# Altium schematic sheet MCP73831_BMS.SchDoc: MCP73831 Battery Management Unit
size A3; SheetNumber: 1; SheetTotal: 1
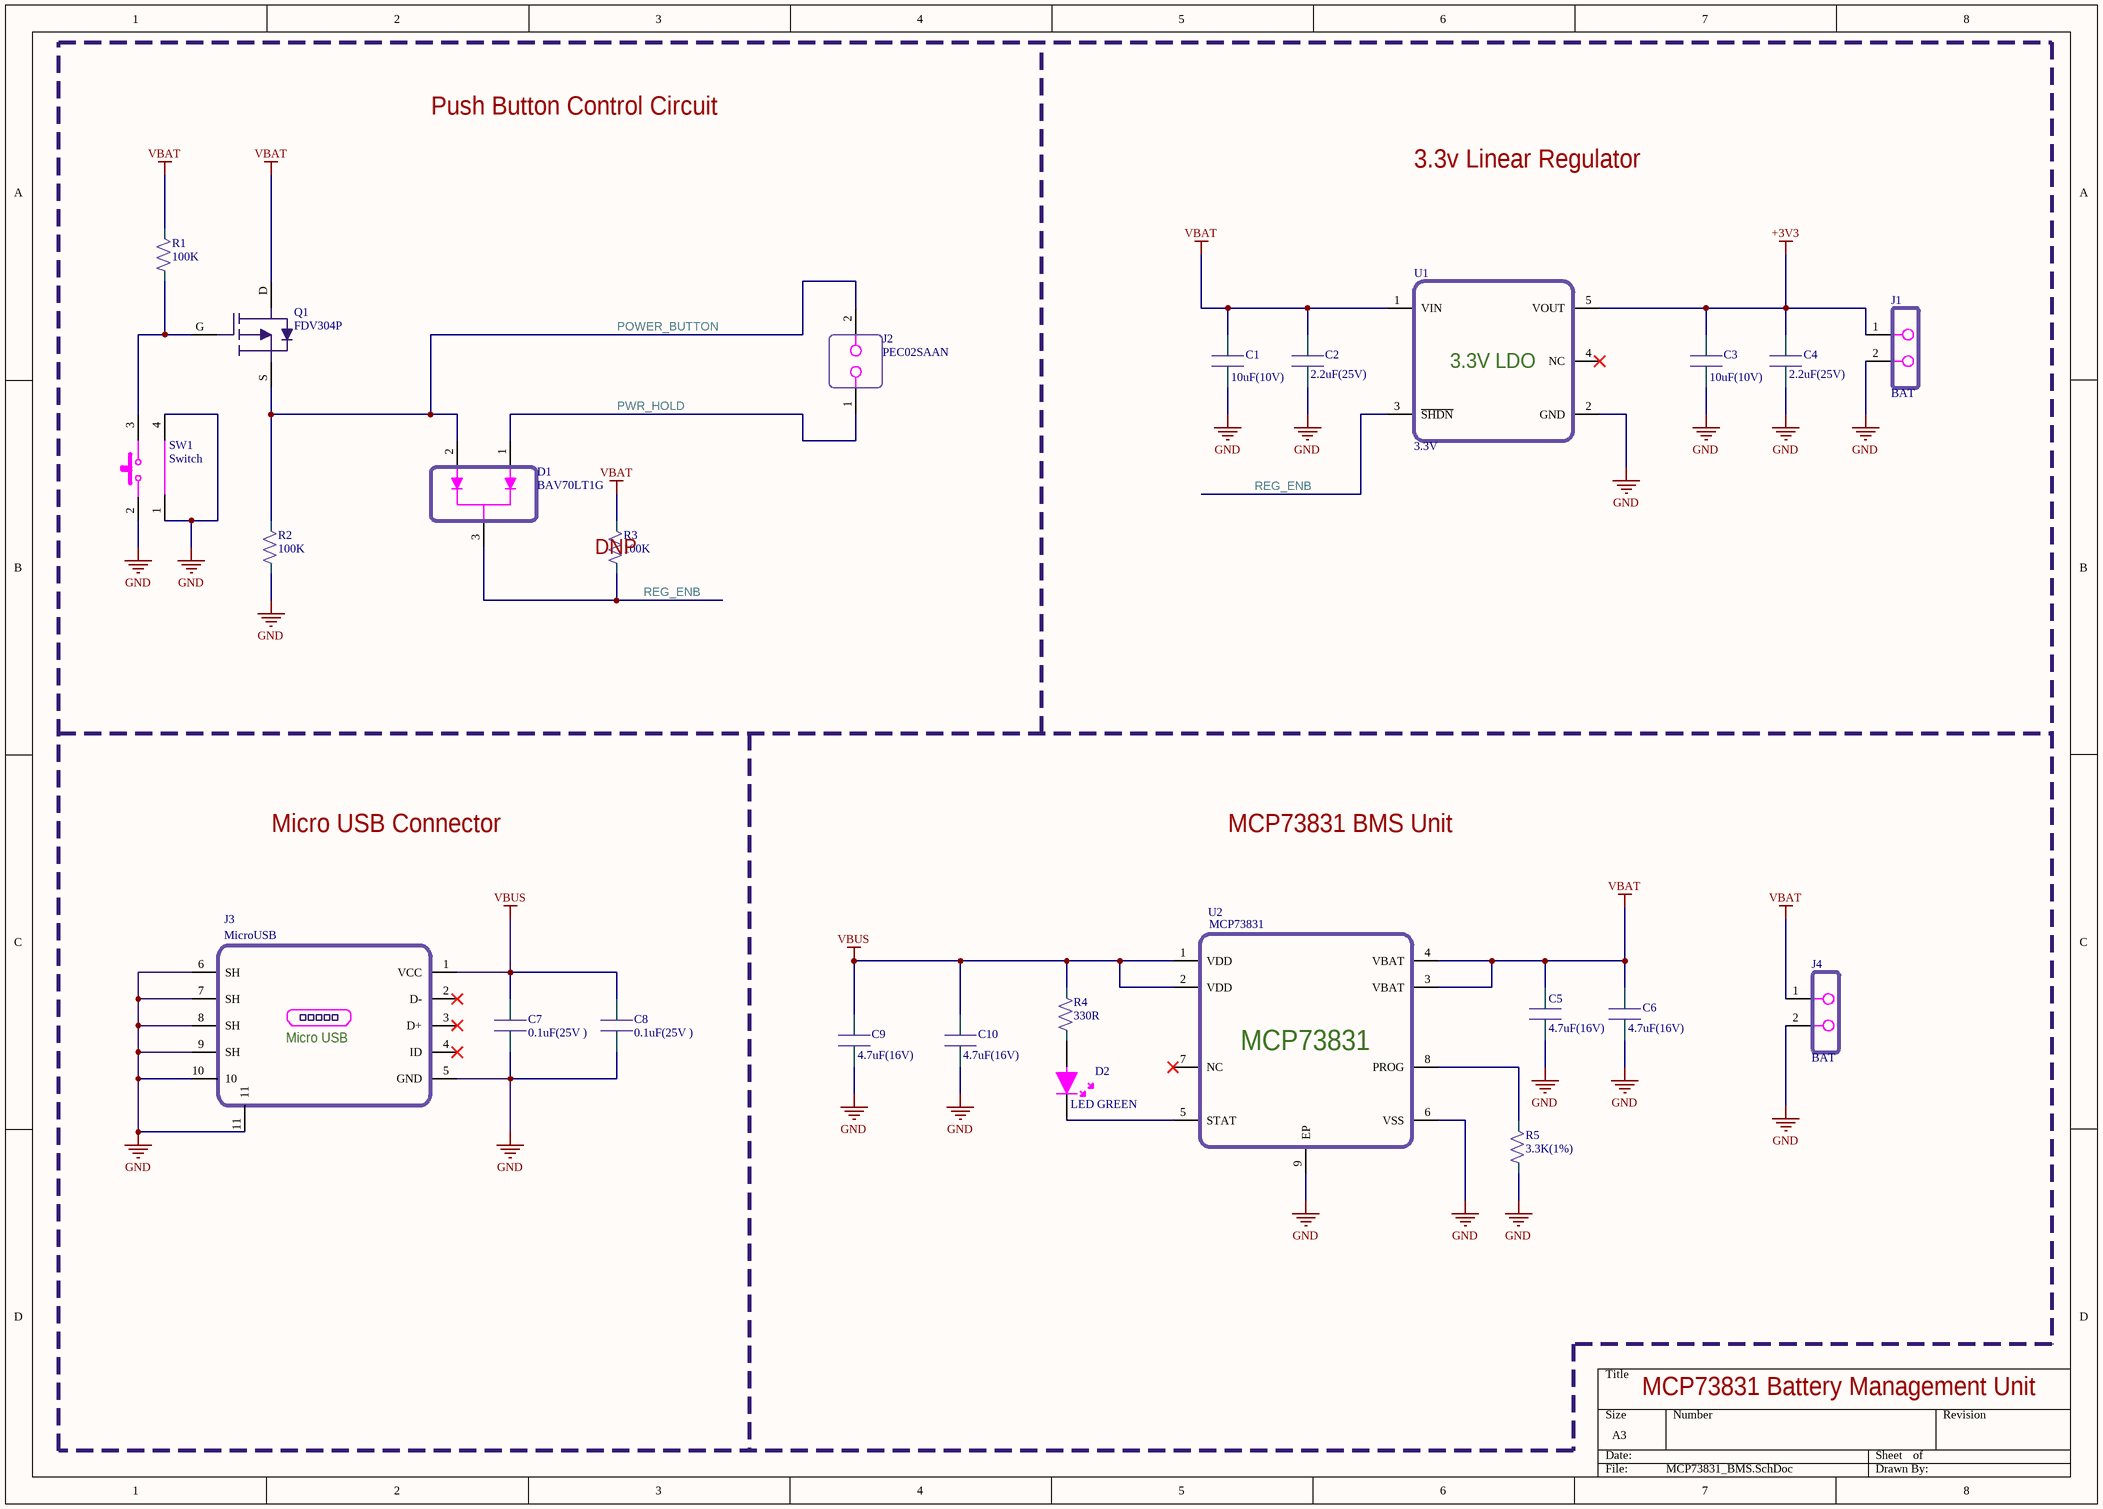
[diagram p0: MCP73831_BMS.SchDoc]

## Parts
C1  10uF(10V)  [CAPACITOR_0402]
C2  2.2uF(25V)  [CAPACITOR_0402]
C3  10uF(10V)  [CAPACITOR_0402]
C4  2.2uF(25V)  [CAPACITOR_0402]
C5  4.7uF(16V)  [CAPACITOR_0402]
C6  4.7uF(16V)  [CAPACITOR_0402]
C7  0.1uF(25V )  [CAPACITOR_0402]
C8  0.1uF(25V )  [CAPACITOR_0402]
C9  4.7uF(16V)  [CAPACITOR_0402]
C10  4.7uF(16V)  [CAPACITOR_0402]
D1  BAV70LT1G  [SOT-23_3LEAD - BAV70]
D2  LED GREEN  [0603_LED]
J1  BAT  [SM02B-SRSS-TB(LF)(SN)]
J2  PEC02SAAN  [P2.541X2HDR]
J3  MicroUSB  [Micro USB]
J4  BAT  [SM02B-SRSS-TB(LF)(SN)]
Q1  FDV304P  [SOT-23_3LEAD]
R1  100K  [RESISTOR_0402]
R2  100K  [RESISTOR_0402]
R3  100K  [RESISTOR_0402]
R4  330R  [RESISTOR_0402]
R5  3.3K(1%)  [RESISTOR_0402]
SW1  Switch  [right angle through hole switch]
U1  3.3V  [SOT23-5LEAD]
U2  MCP73831  [8VFDFN]

## Nets
+3V3: C3.2 C4.2 J1.1 U1.5(VOUT)
GND: C1.1 C2.1 C3.1 C4.1 C5.1 C6.1 C7.1 C8.1 C9.1 C10.1 J1.2 J3.5(GND) J3.6(SH) J3.7(SH) J3.8(SH) J3.9(SH) J3.10 J3.11 J4.2 R2.1 R5.1 SW1.1 SW1.2 SW1.4 U1.2(GND) U2.6(VSS) U2.9(EP)
VBAT: C1.2 C2.2 C5.2 C6.2 J4.1 Q1.D R1.2 R3.2 U1.1(VIN) U2.3(VBAT) U2.4(VBAT)
VBUS: C7.2 C8.2 C9.2 C10.2 J3.1(VCC) R4.2 U2.1(VDD) U2.2(VDD)
POWER_BUTTON: D1.2 J2.2 Q1.S R2.2
PWR_HOLD: D1.1 J2.1
REG_ENB: D1.3 R3.1 U1.3(~{SHDN})
NetD2_1: D2.1 R4.1
NetD2_2: D2.2 U2.5(STAT)
NetQ1_G: Q1.G R1.1 SW1.3
NetR5_2: R5.2 U2.8(PROG)

Not connected (* = marked no-connect by the designer): J3 2(D-)* 3(D+)* 4(ID)*; U1 4(NC)*; U2 7(NC)*

## Notes on the sheet
- Push Button Control Circuit
- 3.3v Linear Regulator
- (near R3) DNP
- Micro USB Connector
- MCP73831 BMS Unit
- (in symbol 629105150521) Micro USB
- (in symbol MCP1812BT-033/OT) 3.3V LDO

## Library data of the parts
C1 C3 = CL05A106MP8NUB8: 10µF ±20% 10V Ceramic Capacitor X5R 0402 (1005 Metric); Manufacturer: Samsung Electro-Mechanics; MinTemp: -55°C; MaxTemp: 85°C; ManufacturerPartNumber: CL05A106MP8NUB8; SupplierPartNumber: 1276-6830-1-ND; Supplier: Digikey; PartStatus: Active; Price: 0.36; ComponentLink1Description: SupplierURL; ComponentLink1URL: https://www.digikey.com/en/products/detail/samsung-electro-mechanics/CL05A106MP8NUB8/5961314
C2 C4 = GRT155R61E225KE13D: 2.2 µF ±10% 25V Ceramic Capacitor X5R 0402 (1005 Metric); Manufacturer: Murata Electronics; PartSatus: Active; MinTemp: -55°C; MaxTemp: 85°C; ManuafcturerPartNumber: GRT155R61E225KE13D; SupplierPartNumber: 490-12267-1-ND; Supplier: Digikey; Price: 0.29; ComponentLink1Description: SupplierURL; ComponentLink1URL: https://www.digikey.com/en/products/detail/murata-electronics/GRT155R61E225KE13D/5416689
C5 C6 C9 C10 = 0402YD475MAT2A: 4.7µF ±20% 16V Ceramic Capacitor X5R 0402 (1005 Metric); Manufacturer: AVX Corporation; MinTemp: -55°C; MaxTemp: 85°C; ManufacturerPartNumber: 0402YD475MAT2A; SupplierPartNumber: 478-10788-1-ND; PartStatus: Active; Price: 0.29; ComponentLink1Description: SupplierURL; ComponentLink1URL: https://www.digikey.com/en/products/detail/avx-corporation/0402YD475MAT2A/6221357; Supplier: Digikey
C7 C8 = GRM155R71E104KE14J: 0.1µF ±10% 25V Ceramic Capacitor X7R 0402 (1005 Metric); Manufacturer: Murata Electronics; MinTemp: -55°C; MaxTemp: 125°C; ManufacturerPartNumber: GRM155R71E104KE14J; SupplierPartNumber: 490-14603-1-ND; Supplier: Digikey; PartStatus: Active; Price: 0.10; ComponentLink1Description: SupplierURL; ComponentLink1URL: https://www.digikey.com/en/products/detail/murata-electronics/GRM155R71E104KE14J/4905174
D1 = BAV70LT1G: Diode Array 1 Pair Common Cathode Standard 200mA (DC) Surface Mount TO-236-3, SC-59, SOT-23-3; Manufacturer: ON Semiconductor; MinTemp: -55°C; MaxTemp: 150°C; ManufacturerPartNumber: BAV70LT1G; SupplierPartNumber: BAV70LT1GOSCT-ND; Supplier: Digikey; PartStatus: Active; Price: 0.14; ComponentLink1Description: SupplierURL; ComponentLink1URL: https://www.digikey.com/en/products/detail/on-semiconductor/BAV70LT1G/918324
D2 = XZVG53W-8: Green 570nm LED Indication - Discrete 2.1V 0603 (1608 Metric); Min Temp: -40°C; Max Temp: +85°C; Manufacturer Part Number: XZVG53W-8; Supplier Part Number: 1497-1215-1-ND; Part Status: Active; Price: 0.36; ComponentLink1Description: Supplier Link; ComponentLink1URL: https://www.digikey.com/en/products/detail/sunled/XZVG53W-8/4745971
J1 J4 = SM02B-SRSS-TB(LF)(SN): Connector Header Surface Mount, Right Angle 2 position 0.039" (1.00mm); Manufacturer: JST Sales America Inc.; MinTemp: -25°C; MaxTemp: 85°C; ManufacturerPartNumber: SM02B-SRSS-TB(LF)(SN); SupplierPartNumber: 455-1802-1-ND; Supplier: Digikey; PartStatus: Active; Price: 0.47; ComponentLink1Description: SupplierURL; ComponentLink1URL: https://www.digikey.com/en/products/detail/jst-sales-america-inc/SM02B-SRSS-TB-LF-SN/926708
J2 = PEC02SAAN: Connector Header Through Hole 2 position 0.100" (2.54mm); Min Temp: -65°C; Max Temp: 125°C; Manyfacturer Part Number: PEC02SAAN; Supplier Part Number: S1012E-02-ND; Part Status: Active; Price: 0.18; ComponentLink1Description: Supplier Link; ComponentLink1URL: https://www.digikey.com/en/products/detail/sullins-connector-solutions/PEC02SAAN/859155
J3 = 629105150521: USB - micro B USB 2.0 Receptacle Connector 5 Position Surface Mount, Right Angle; Through Hole; Manufacturer: Würth Elektronik; MinTemp: -40°C; MaxTemp: 85°C; ManufacturerPartNumber: 629105150521; SupplierPartNumber: 732-5960-1-ND; Supplier: Digikey; PartStatus: Active; Price: 2.07; ComponentLink1Description: SupplierURL; ComponentLink1URL: https://www.digikey.com/en/products/detail/würth-elektronik/629105150521/5047751
Q1 = FDV304P: P-Channel 460mA (Ta) 350mW (Ta) Surface Mount SOT-23; Manufacturer: ON Semiconductor; MinTemp: -55°C; MaxTemp: 150°C; ManufacturerPartNumber: FDV304P; SupplierPartNumber: FDV304PCT-ND; Supplier: Digikey; PartStatus: Active; Price: 0.34; ComponentLink1Description: SupplierURL; ComponentLink1URL: c; ComponentLink2Description: MouserURL; ComponentLink2URL: https://www.mouser.in/ProductDetail/Microchip-Technology/MCP1812BT-033-OT?qs=byeeYqUIh0NTmNeIvl%2Fnbw%3D%3D
R1-R3 = ERJ-2GEJ104X: 100 kOhms ±5% 0.1W, 1/10W Chip Resistor 0402 (1005 Metric) Automotive AEC-Q200 Thick Film; Manufacturer: Panasonic Electronic Components; MinTemp: -55°C; MaxTemp: 155°C; ManufacturerPartNumber: ERJ-2GEJ104X; SupplierPartNumber: P100KJCT-ND; Supplier: Digikey; PartStatus: Active; Price: 0.10; ComponentLink1Description: SupplierURL; ComponentLink1URL: https://www.digikey.com/en/products/detail/panasonic-electronic-components/ERJ-2GEJ104X/146731
R4 = CRGCQ0603J330R: ±5% 0.1W, 1/10W Chip Resistor 0603 (1608 Metric) Automotive AEC-Q200, Moisture Resistant Thick Film; Manufacturer: TE Connectivity Passive Product; MinTemp: -55°C; MaxTemp: 155°C; ManufacturerPartNumber: CRGCQ0603J330R; SupplierPartNumber: A130088CT-ND; Supplier: Digikey; PartStatus: Active; Price: 0.10; ComponentLink1Description: SupplierURL; ComponentLink1URL: https://www.digikey.com/en/products/detail/te-connectivity-passive-product/CRGCQ0603J330R/8576690
R5 = RK73H1ETTP3301F: 3.3 ±1% 0.1W, 1/10W Chip Resistor 0402 (1005 Metric) Automotive AEC-Q200, Moisture Resistant Thick Film; Manufacturer: KOA Speer Electronics, Inc.; MinTemp: -55°C; MaxTemp: 155°C; ManufacturerPartNumber: RK73H1ETTP3301F; SupplierPartNumber: 2019-RK73H1ETTP3301FCT-ND; Supplier: Digikey; PartStatus: Active; Price: 0.10; ComponentLink1Description: SupplierURL; ComponentLink1URL: https://www.digikey.com/en/products/detail/koa-speer-electronics-inc/RK73H1ETTP3301F/9844094
SW1 = 1301.9502: Tactile Switch SPST-NO Side Actuated Through Hole, Right Angle; Manufacturer: Schurter Inc.; MinTemp: -20°C; MaxTemp: 70°C; ManufacturerPartNumber: 1301.9502; SupplierPartNumber: 486-3472-ND; Supplier: Digikey; PartStatus: Active; Price: 0.30; ComponentLink1Description: SupplierURL; ComponentLink1URL: https://www.digikey.com/en/products/detail/schurter-inc/1301-9502/7602720; ComponentLink2Description: rydoLabs; ComponentLink2URL: https://www.rhydolabz.com/hardwares-switches-c-170_171/right-angle-tactile-push-button-switch-5mm-shaft-dip-p-2817.html
U1 = MCP1812BT-033/OT: LDO Voltage Regulators Ultra Low Iq LDO; Manufacturer: Microchip Technology; MinTemp: - 40 C; MaxTemp: + 85 C; ManuafcturerPartNumber: MCP1812BT-033/OT; SupplierPartNumber: 579-MCP1812BT-033/OT; Supplier: Mouser; PartStatus: Active; Price: 29.11(INR); ComponentLink1Description: SupplierURL; ComponentLink1URL: https://www.mouser.in/ProductDetail/Microchip-Technology/MCP1812BT-033-OT?qs=byeeYqUIh0NTmNeIvl%2Fnbw%3D%3D
U2 = MCP73831T-2DCI/MC: Charger IC Lithium Ion/Polymer 8-DFN (2x3); Manufacturer: Microchip Technology; MinTemp: -40°C; MaxTemp: 85°C; ManufacturerPartNumber: MCP73831T-2DCI/MC; SupplierPartNumber: MCP73831T-2DCI/MCCT-ND; Supplier: Digikey; PartStatus: Active; Price: 0.62; ComponentLink1Description: SupplierURL; ComponentLink1URL: https://www.digikey.in/en/products/detail/microchip-technology/MCP73831T-2DCI-MC/964304